# EAGLE design ProductQ (EAGLE 8.6.1)
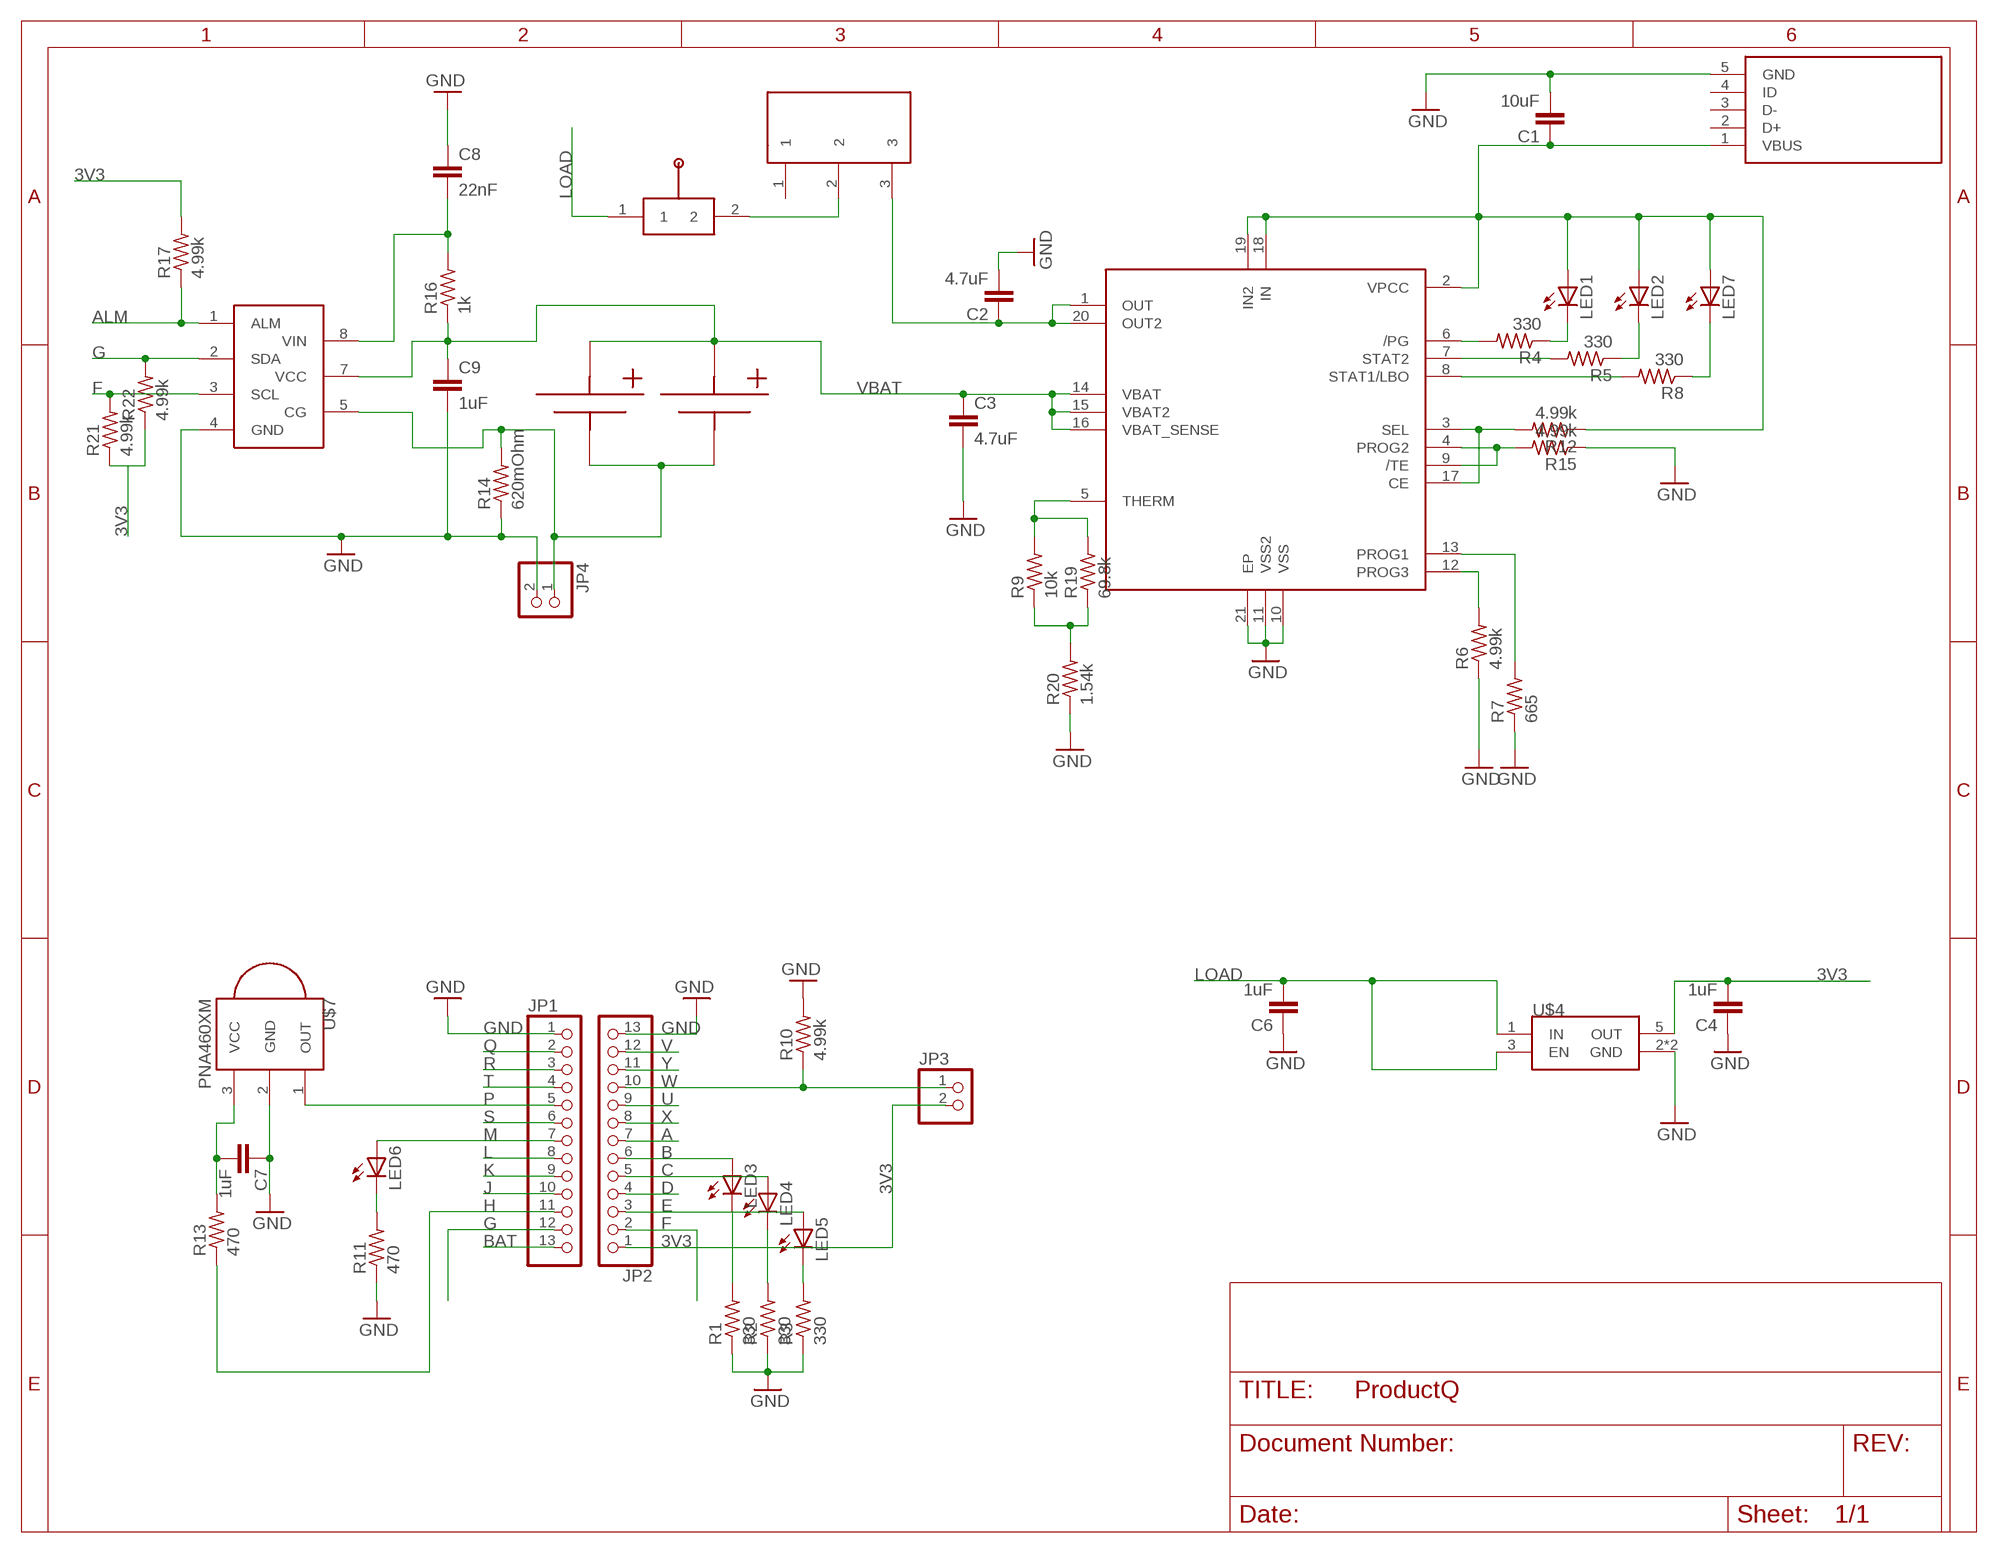
[diagram p0: schematic, sheet 1]

## Parts
C1  10uF  C-EUC0402  [C0402]
C2  4.7uF  C-EUC0402  [C0402]
C3  4.7uF  C-EUC0402  [C0402]
C4  1uF  C-EUC0402  [C0402]
C6  1uF  C-EUC0402  [C0402]
C7  1uF  C-EUC0402  [C0402]
C8  22nF  C-EUC0402  [C0402]
C9  1uF  C-EUC0402  [C0402]
JP1  PINHD-1X13  [1X13]
JP2  PINHD-1X13  [1X13]
JP3  PINHD-1X2/90  [1X02/90]
JP4  PINHD-1X2  [1X02]
LED1  LEDCHIP-LED0805  [CHIP-LED0805]
LED2  LEDCHIP-LED0805  [CHIP-LED0805]
LED3  LEDCHIP-LED0805  [CHIP-LED0805]
LED4  LEDCHIP-LED0805  [CHIP-LED0805]
LED5  LEDCHIP-LED0805  [CHIP-LED0805]
LED6  LED3MM  [LED3MM]
LED7  LEDCHIP-LED0805  [CHIP-LED0805]
R1  330  R-US_R0402  [R0402]
R2  330  R-US_R0402  [R0402]
R3  330  R-US_R0402  [R0402]
R4  330  R-US_R0402  [R0402]
R5  330  R-US_R0402  [R0402]
R6  4.99k  R-US_R0402  [R0402]
R7  665  R-US_R0402  [R0402]
R8  330  R-US_R0402  [R0402]
R9  10k  R-US_R0402  [R0402]
R10  4.99k  R-US_R0402  [R0402]
R11  470  R-US_R0402  [R0402]
R12  4.99k  R-US_R0402  [R0402]
R13  470  R-US_R0402  [R0402]
R14  620mOhm  R-US_R0603  [R0603]
R15  4.99k  R-US_R0402  [R0402]
R16  1k  R-US_R0402  [R0402]
R17  4.99k  R-US_R0402  [R0402]
R19  69.8k  R-US_R0402  [R0402]
R20  1.54k  R-US_R0402  [R0402]
R21  4.99k  R-US_R0402  [R0402]
R22  4.99k  R-US_R0402  [R0402]
U$1  MCP73871  [QFN_20]
U$2  SPDT_THRU  [SPDT_THRU]
U$3  USB_MINI  [USB_MINI]
U$4  TPS782XX  [SOT23-5L]
U$5  18650SMD  [18650KEYSTONE]
U$6  18650SMD  [18650KEYSTONE]
U$7  PNA460XM  [PNA460XM]
U$8  STC3105  [STC3105]
U$9  MANUAL_SWITCH  [MANUAL_SWITCH]

## Nets
3V3: C4.2 JP2.1 JP3.2 R17.2 R21.1 R22.1 U$4.5(OUT)
A: JP2.7
ALM: R17.1 U$8.1(ALM)
B: JP2.6 LED3.A
BAT: JP1.13
C: JP2.5 LED4.A
D: JP2.4
E: JP2.3 LED5.A
F: JP2.2 R21.2 U$8.3(SCL)
G: JP1.12 R22.2 U$8.2(SDA)
GND: C1.2 C2.2 C3.2 C4.1 C6.1 C7.1 C8.1 C9.2 JP1.1 JP2.13 JP4.2 R1.1 R2.1 R3.1 R6.1 R7.1 R10.2 R11.1 R14.1 R15.1 R20.1 U$1.10(VSS) U$1.11(VSS2) U$1.21(EP) U$3.5(GND) U$4.2(GND) U$4.4(GND) U$7.2(GND) U$8.4(GND)
H: JP1.11 R13.1
J: JP1.10
K: JP1.9
L: JP1.8
LOAD: C6.2 U$4.1(IN) U$4.3(EN) U$9.1
M: JP1.7 LED6.A
N$1: JP4.1 R14.2 U$5.P$2 U$6.P$2 U$8.5(CG)
N$2: R9.2 R19.2 U$1.5(THERM)
N$3: R7.2 U$1.13(PROG1)
N$4: R6.2 U$1.12(PROG3)
N$5: LED6.K(C) R11.2
N$6: LED4.C R2.2
N$7: R4.2 U$1.6(/PG)
N$8: LED1.C R4.1
N$9: LED2.C R5.1
N$10: R5.2 U$1.7(STAT2)
N$11: R8.2 U$1.8(STAT1/LBO)
N$12: LED7.C R8.1
N$13: LED5.C R3.2
N$14: LED3.C R1.2
N$15: C8.2 R16.2 U$8.8(VIN)
N$16: C1.1 LED1.A LED2.A LED7.A R12.1 U$1.2(VPCC) U$1.18(IN) U$1.19(IN2) U$3.1(VBUS)
N$17: C7.2 R13.2 U$7.3(VCC)
N$18: R12.2 U$1.3(SEL) U$1.17(CE)
N$20: R15.2 U$1.4(PROG2) U$1.9(/TE)
N$21: U$2.2 U$9.2
N$23: C2.1 U$1.1(OUT) U$1.20(OUT2) U$2.3
N$24: R9.1 R19.1 R20.2
P: JP1.5 U$7.1(OUT)
Q: JP1.2
R: JP1.3
S: JP1.6
T: JP1.4
U: JP2.9
V: JP2.12
VBAT: C3.1 C9.1 R16.1 U$1.14(VBAT) U$1.15(VBAT2) U$1.16(VBAT_SENSE) U$5.P$1 U$6.P$1 U$8.7(VCC)
W: JP2.10 JP3.1 R10.1
X: JP2.8
Y: JP2.11
Unconnected: U$2.1 U$3.2(D+) U$3.3(D-) U$3.4(ID)

## Library data of the parts
C1-C4 C6-C9 = rcl:C-EU: CAPACITOR, European symbol
JP1 JP2 = pinhead:PINHD-1X13: PIN HEADER
JP3 JP4 = pinhead:PINHD-1X2: PIN HEADER
LED1-LED7 = adafruit:LED: LED OSRAM: - CHIPLED LG R971, LG N971, LY N971, LG Q971, LY Q971, LO R971, LY R971 LH N974, LH R974 LS Q976, LO Q976, LY Q976 LO Q996 - Hyper CHIPLED LW Q18S LB Q993, LB Q99A, LB R99A - SideLED LS A670, LO A670, LY A670, LG A670, LP A670 LB A673, LV A673, LT A673, LW A673 LH A674 LY A675 LS A676, LA A676, LO A676, LY A676, LW A676 LS A679, LY A679, LG A679 - Hyper Micro SIDELED® LS Y876, LA Y876, LO Y876, LY Y876 LT Y87S - SmartLED LW L88C, LW L88S LB L89C, LB L89S, LG L890 LS L89K, LO L89K, LY L89K LS L896, LA L896, LO L896, LY L896 - TOPLED LS T670, LO T670, LY T670, LG T670, LP T670 LSG T670, LSP T670, LSY T670, LOP T670, LYG T670 LG T671, LOG T671, LSG T671 LB T673, LV T673, LT T673, LW T673 LH T674 LS T676, LA T676, LO T676, LY T676, LB T676, LH T676, LSB T676, LW T676 LB T67C, LV T67C, LT T67C, LS T67K, LO T67K, LY T67K, LW E67C LS E67B, LA E67B, LO E67B, LY E67B, LB E67C, LV E67C, LT E67C LW T67C LS T679, LY T679, LG T679 LS T770, LO T770, LY T770, LG T770, LP T770 LB T773, LV T773, LT T773, LW T773 LH T774 LS E675, LA E675, LY E675, LS T675 LS T776, LA T776, LO T776, LY T776, LB T776 LHGB T686 LT T68C, LB T68C - Hyper Mini TOPLED® LB M676 - Mini TOPLED Santana® LG M470 LS M47K, LO M47K, LY M47K Source: http://www.osram.convergy.de/
R1-R17 R19-R22 = rcl:R-US_: RESISTOR, American symbol
U$1 = James_Updated:MCP73871
U$2 = James_Updated:SPDT_THRU
U$3 = James_Updated:USB_MINI
U$4 = James_Updated[Conflict]:TPS782XX: TPS782 500-nA IQ,150-mA, Ultra-Low Quiescent Current Low-Dropout Linear Regulator
U$5 U$6 = Charles:18650: 18650 Battery Cell Holder
U$7 = adafruit:PNA460XM: IR 38KHz receiver PNA4602 and related receivers http://www.ladyada.net/library/pcb/eaglelibrary.html
U$8 = James_Updated:STC3105: Battery monitor IC with alarm output for gas gauge applications
U$9 = James_Updated:MANUAL_SWITCH

## Board
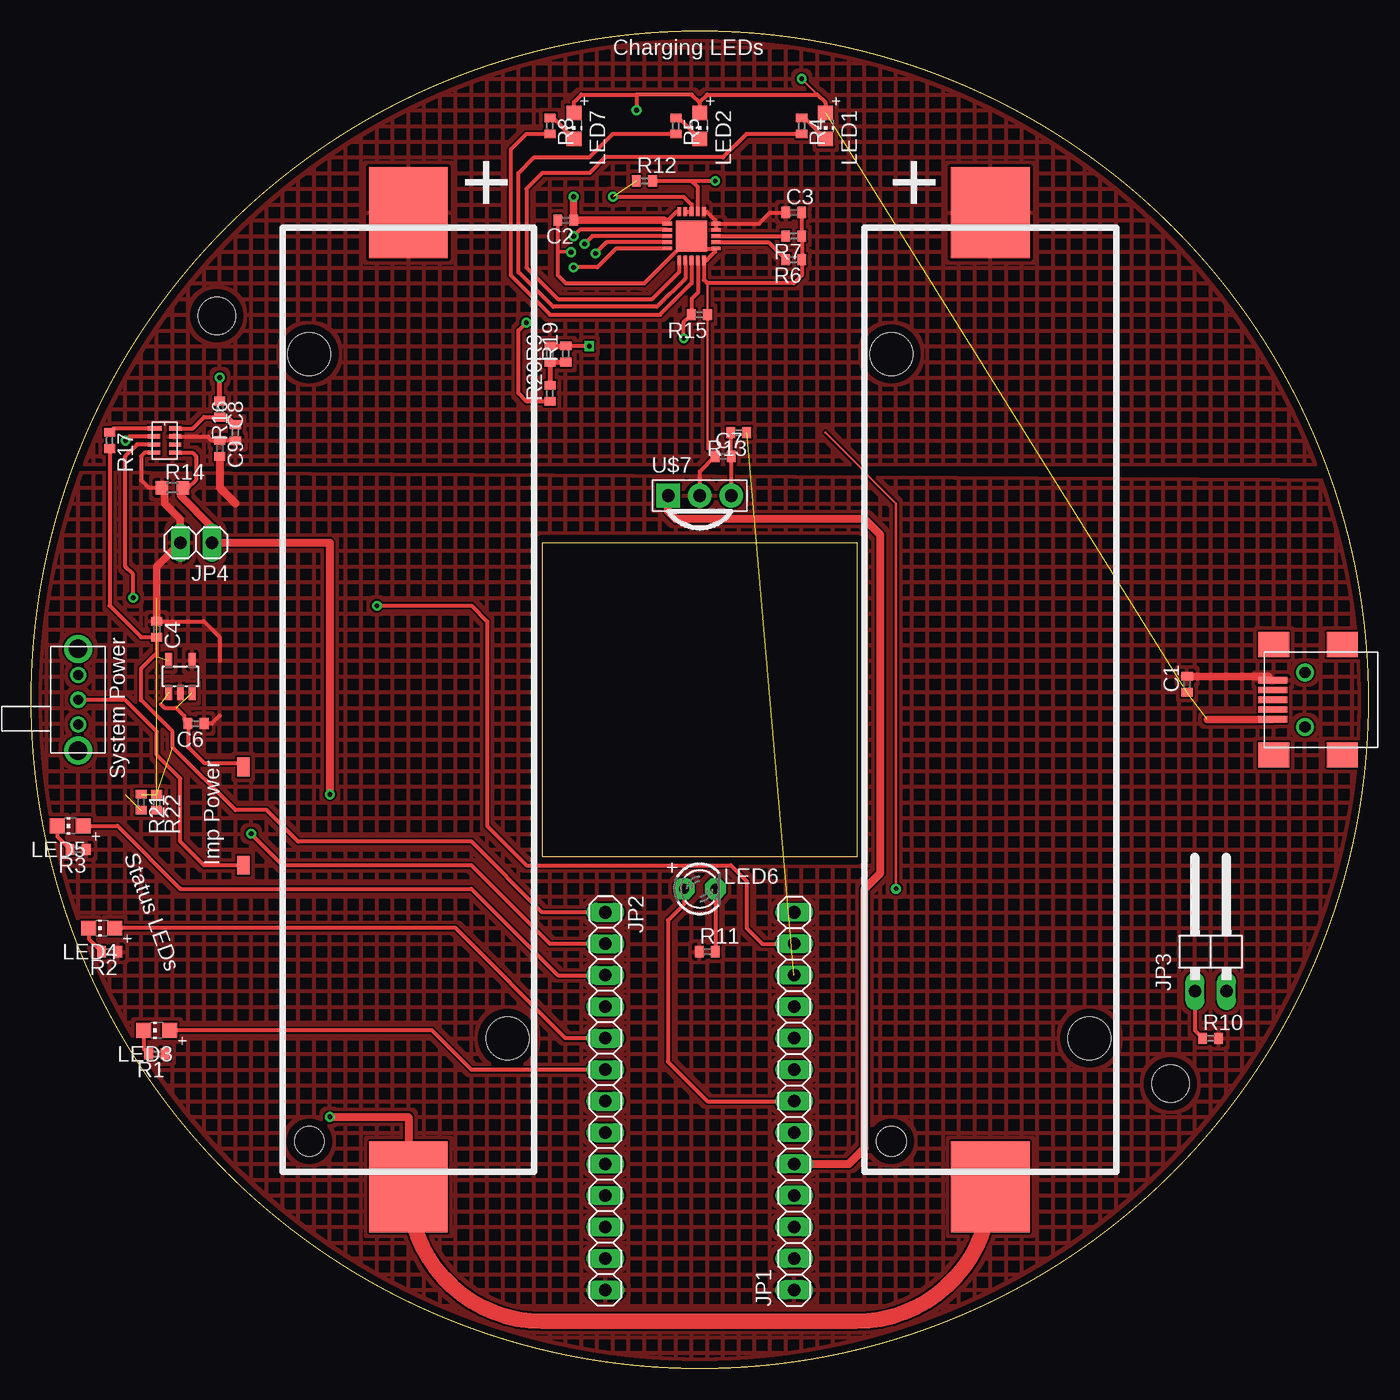
[diagram p1: board, top side]
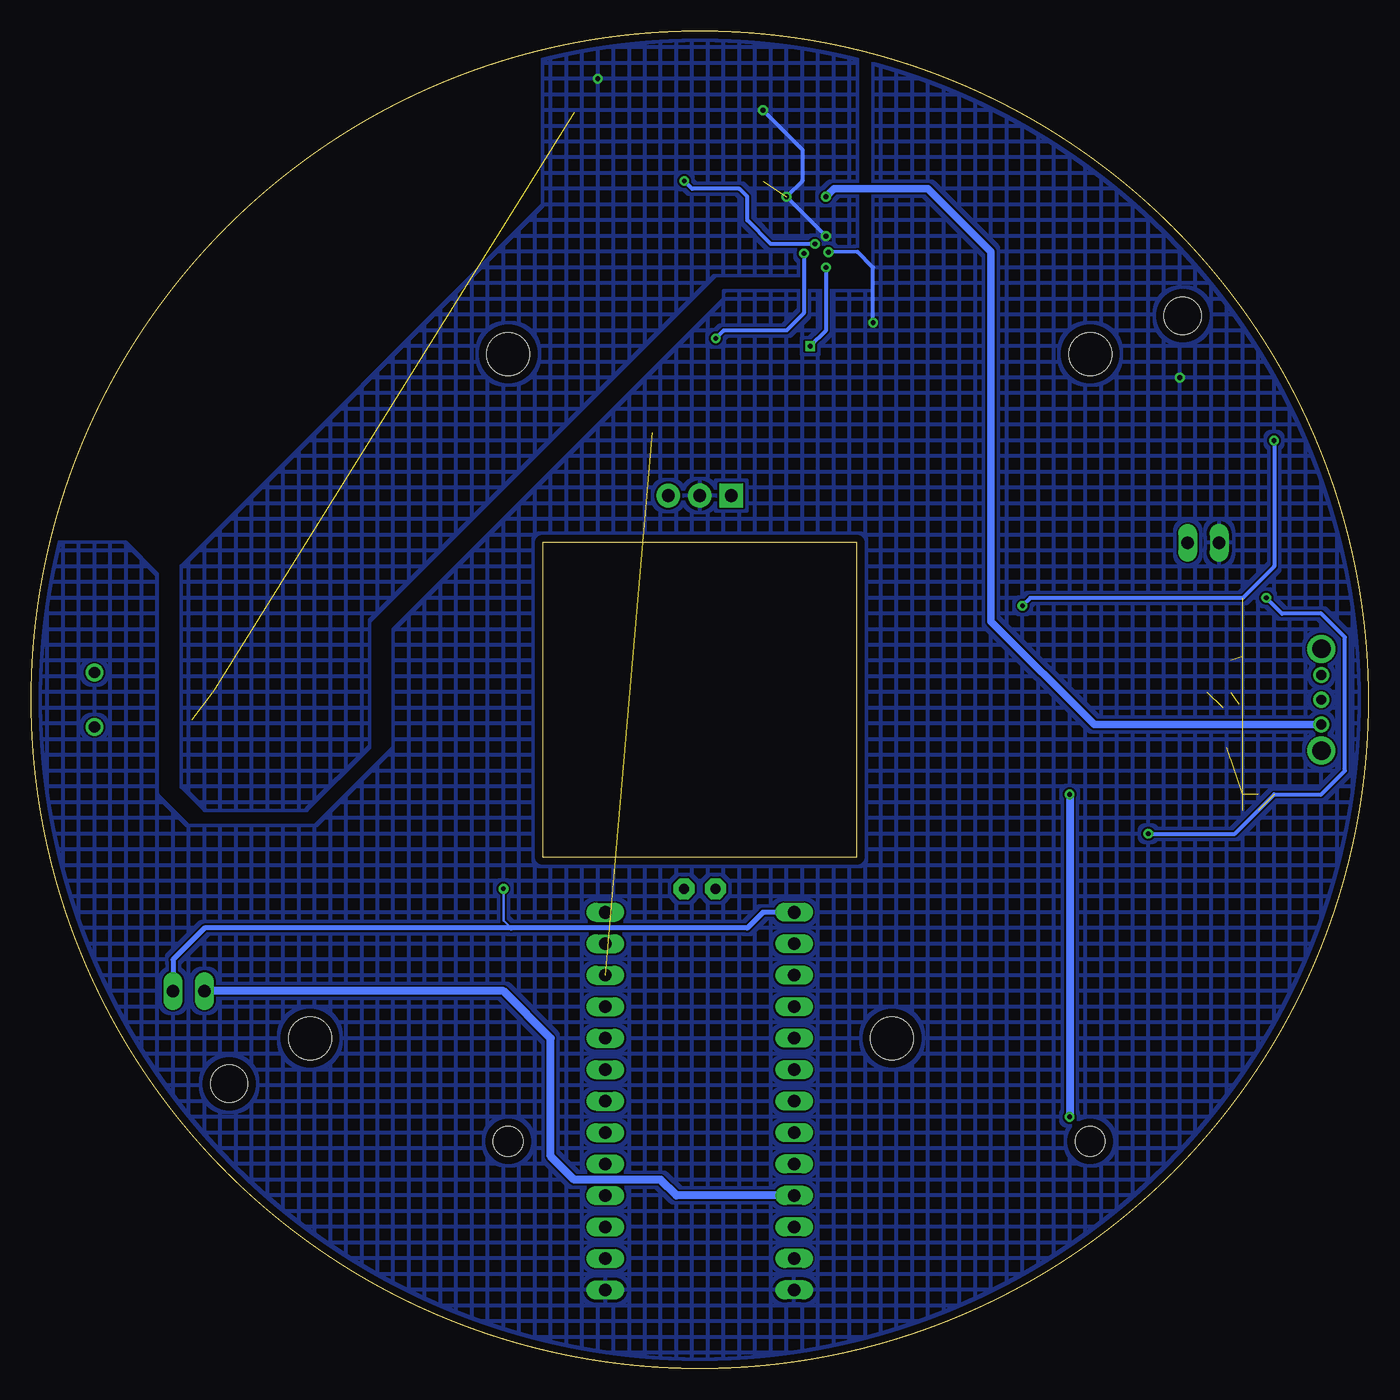
[diagram p2: board, bottom side, seen from below]

Size 108 x 108 mm. Coordinates in mm from the lower left corner, seen from the top.
Outline: 41.3,66.7 66.7,66.7 66.7,41.3 41.3,41.3 41.3,66.7
Outline: circle at 54,54 radius 54
Copper layers (1*16): Top 0.035mm / dielectric 1.5mm / Bottom 0.035mm
Design rules "DRC_rules": minimum track width 8mil, minimum drill 15mil, track to track 6mil, track to pad 6mil, pad to pad 6mil, via to via 6mil, smd to smd 6mil, copper to edge 25mil, drill to drill 6mil, minimum pad ring 10mil, minimum via ring 8mil, stop-mask expansion 4mil, vias tented up to drill 0mil, thermal gap 10mil
Holes 3 mm at 92,23 15,85

### Footprints (pad centres in the part's own frame; a part is rotated, then mirrored left to right if it is on the bottom)
C0402 = smd 0.7 x 0.9: 1 -0.65,0; 2 0.65,0
1X13 = drill 1.016 long: 1 -15.24,0; 2 -12.7,0; 3 -10.16,0; 4 -7.62,0; 5 -5.08,0; 6 -2.54,0; 7 0,0; 8 2.54,0; 9 5.08,0; 10 7.62,0; 11 10.16,0; 12 12.7,0; 13 15.24,0
1X02/90 = drill 1.016 long: 1 -1.27,-3.81; 2 1.27,-3.81
1X02 = drill 1.016 long: 1 -1.27,0; 2 1.27,0
CHIP-LED0805 = smd 1.2 x 1.2: A 0,-1.05; C 0,1.05
LED3MM = drill 0.813 pad 1.676 octagon: A -1.27,0; K 1.27,0
R0402 = smd 0.7 x 0.9: 1 -0.65,0; 2 0.65,0
R0603 = smd 1 x 1.1: 1 -0.85,0; 2 0.85,0
QFN_20 = smd 0.73 x 0.3: 1 -1.965,1; 2 -1.965,0.5; 3 -1.965,0; 4 -1.965,-0.5; 5 -1.965,-1; 11 1.965,-1; 12 1.965,-0.5; 13 1.965,0; 14 1.965,0.5; 15 1.965,1 | smd 0.3 x 0.73: 6 -1,-1.965; 7 -0.5,-1.965; 8 0,-1.965; 9 0.5,-1.965; 10 1,-1.965; 16 1,1.965; 17 0.5,1.965; 18 0,1.965; 19 -0.5,1.965; 20 -1,1.965 | smd 2.5 x 2.5: 21 0,0
SPDT_THRU = drill 0.787: 1 -2.007,0; 2 0,0; 3 2.007,0 | drill 1.499: A1 -4.102,0; A2 4.102,0
USB_MINI = smd 0.508 x 2.311: 1 -1.575,2.603; 2 -0.787,2.603; 3 0,2.603; 4 0.787,2.603; 5 1.575,2.603 | smd 2.007 x 2.489: S1 -4.445,2.515; S2 4.445,2.515; S3 -4.445,-2.997; S4 4.445,-2.997 | drill 0.914: S5 -2.197,0; S6 2.197,0
SOT23-5L = smd 0.55 x 1.2: 1 -0.95,-1.3; 2 0,-1.3; 3 0.95,-1.3; 4 0.95,1.3; 5 -0.95,1.3
18650KEYSTONE = smd 7.341 x 6.35: P$1 -39.332,0; P$2 39.332,0 | hole 3.454: 27.33,8.001; -27.915,-8.001 | hole 2.388: 35.662,-8.001
PNA460XM = drill 1.016 pad 1.93 square: 1 -2.54,0 | drill 1.016 pad 1.93: 2 0,0; 3 2.54,0
STC3105 = smd 0.35 x 1.1: 1 -0.975,-0.8 | smd 0.35 x 1: 2 -0.325,-0.85; 3 0.325,-0.85; 4 0.975,-0.85; 5 0.975,0.85; 6 0.325,0.85; 7 -0.325,0.85; 8 -0.975,0.85
MANUAL_SWITCH = smd 1.524 x 1.016: 1 -4.13,0; 2 3.81,0

### Placement (x,y rotation side)
C1  93.34,55.24 90 top
C2  43.18,92.71 180 top
C3  61.59,93.34 0 top
C4  10.16,59.69 270 top
C6  13.34,52.07 180 top
C7  55.88,73.66 0 top
C8  15.24,77.47 270 top
C9  15.24,74.3 270 top
JP1  61.62,21.59 90 top
JP2  46.38,21.59 270 top
JP3  95.25,34.29 0 top
JP4  13.34,66.67 180 top
LED1  64.16,100.33 180 top
LED2  54,100.33 180 top
LED3  10.16,27.3 90 top
LED4  5.71,35.56 90 top
LED5  3.17,43.81 90 top
LED6  54,38.73 0 top
LED7  43.84,100.33 180 top
R1  10.16,25.4 180 top
R2  6.35,33.66 180 top
R3  3.81,41.91 180 top
R4  62.23,100.33 270 top
R5  52.07,100.33 270 top
R6  61.59,89.53 180 top
R7  61.59,91.44 180 top
R8  41.91,100.33 270 top
R9  41.91,81.92 90 top
R10  95.25,26.67 0 top
R11  54.61,33.66 0 top
R12  49.53,95.89 0 top
R13  57.15,75.56 180 top
R14  11.43,71.12 0 top
R15  53.98,85.09 180 top
R16  16.51,75.56 90 top
R17  6.35,74.93 270 top
R19  43.18,81.92 90 top
R20  41.91,78.74 90 top
R21  8.89,45.72 270 top
R22  10.16,45.72 270 top
U$1  53.34,91.44 0 top
U$2  3.81,54 270 top
U$3  102.87,54 90 top
U$4  12.06,55.88 0 top
U$5  77.47,54 270 top
U$6  30.48,54 270 top
U$7  54,70.48 0 top
U$8  10.79,74.93 270 top
U$9  17.14,44.45 270 top

### Tracks (layer width: path | path; a pad name or v marks a point on that pad's centre or on a via)
3V3  (via drill 0.38)  (3 unrouted)
  Top 0.203: 64.14,75.56 69.85,69.85 v69.85,38.73
  Top 0.305: 10.16,57.78 C4.2 10.14,59.05 8.89,59.05 6.35,61.59 R17.2 | 10.16,57.78 10.16,57.5 | JP2.1 41.27,36.83 35.56,42.55 21.59,42.55 19.05,45.09 16.51,45.09 11.43,50.16 11.43,51.44 8.89,53.98 8.89,56.52 10.16,57.78
  Bottom 0.203: v69.85,38.73 69.85,36.2 69.22,35.56
  Bottom 0.406: JP2.1 48.9,36.83 50.16,35.56 69.22,35.56 93.98,35.56 96.52,33.02 JP3.2
ALM
  Top 0.305: U$8.1 6.67,75.91 R17.1
B
  Top 0.305: JP2.6 35.56,24.13 32.38,27.3 LED3.A
C
  Top 0.305: JP2.5 43.18,26.67 34.29,35.56 LED4.A
E
  Top 0.305: LED5.A 6.99,43.81 12.06,38.73 35.56,38.73 42.55,31.75 JP2.3
F  (via drill 0.38)  (1 unrouted)
  Top 0.305: JP2.2 41.91,34.29 35.56,40.64 20.32,40.64 v17.78,43.18 | v8.26,62.23 8.26,64.14 7.62,64.77 7.62,73.66 8.56,74.61 U$8.3
  Bottom 0.305: v17.78,43.18 10.79,43.18 7.62,46.35 3.81,46.35 1.91,48.26 1.91,59.05 3.81,60.96 6.99,60.96 v8.26,62.23
G  (via drill 0.38)  (1 unrouted)
  Top 0.305: U$8.2 7.95,75.25 v7.62,74.93 | v27.94,61.59 35.56,61.59 36.83,60.33 36.83,43.81 40.01,40.64 56.52,40.64 57.78,39.37 57.78,35.56 59.05,34.29 JP1.12
  Bottom 0.305: v7.62,74.93 7.62,64.77 10.16,62.23 27.3,62.23 v27.94,61.59
GND  (via drill 0.38)
  Top 0.203: 54.61,87.63 54.61,85.11 R15.1 54.62,74.27 C7.1
  Top 0.305: U$7.2 54,72.43 C7.1 | 15.26,52.72 14.61,52.07 C6.1 | C4.1 10.16,60.33 13.97,60.33 15.24,59.05 15.24,57.16 | 10.79,71.11 R14.1 9.53,71.12 8.89,71.75 8.89,73.66 9.19,73.95 U$8.4 | 55.24,90.38 55.24,90.17 54.55,89.47 U$1.10 54.34,87.9 54.61,87.63 61.59,87.63 62.24,88.28 R7.1 | 55.24,90.38 U$1.11 | R7.1 C3.2 | R7.1 R6.1 | C2.2 42.53,90.17 | 42.53,90.17 42.53,88.28 43.18,87.63 49.52,87.63 49.52,87.61 U$1.21 54.4,90.38 55.24,90.38 | 99.95,55.9 U$3.5 | R20.1 40.02,78.09 39.37,78.74 39.37,83.82 v40.01,84.45 | v43.61,90.14 42.53,90.17
  Top 0.406: C8.1 v15.24,80.01
  Top 0.61: 10.79,71.11 10.79,69.85 12.06,68.58 JP4.2 10.16,64.77 C4.1 | C1.2 99.95,55.9
  Top 0.635: C9.2 15.24,71.12 16.51,69.85
  Bottom 0.305: v40.01,84.45 40.01,88.9 41.27,90.17 v43.61,90.14
  pour Top (hatched): 3.17,72.39 107.31,71.75 114.3,64.77 114.3,12.7 100.33,-1.27 20.32,0.64 -0.64,21.59 -1.27,67.94
  pour Bottom (hatched): -1.27,71.75 -1.27,85.72 22.23,109.22 38.73,109.22 40.01,107.95 40.01,87 52.07,87 52.07,86.36 78.74,59.69 78.74,50.16 85.09,43.81 95.25,43.81 97.79,46.35 97.79,64.14 100.33,66.67 108.58,66.67 111.12,64.14 103.5,15.88 87,-0.64 30.48,-1.27 -1.27,33.66 -2.54,68.58
H  (1 unrouted)
LOAD  (2 unrouted)
  Top 0.305: 10.48,53.66 10.79,53.34 11.74,53.34 12.38,52.7 12.38,52.38 C6.2 12.69,50.18 13.97,48.9 16.83,48.9 U$9.1
M
  Top 0.305: LED6.A 52.73,37.49 51.44,36.2 51.44,24.77 54.61,21.59 JP1.7
N$1  (via drill 0.38)
  Top 0.305: R14.2 12.7,71.12 13.34,71.75 13.34,73.66 13.04,73.95 U$8.5
  Top 0.61: R14.2 12.08,70.47 14.61,67.94 JP4.1
  Top 0.635: JP4.1 24.13,66.67 v24.13,46.35 | v24.13,20.32 30.48,20.32 U$6.P$2
  Top 1.27: 30.48,14.61 arc90 41.27,3.81 66.61,3.81 arc90 U$5.P$2
  Top 2.54: U$6.P$2 30.48,14.61
  Bottom 0.635: v24.13,46.35 v24.13,20.32
N$2  (via drill 0.38)
  Top 0.305: U$1.5 47.26,90.44 45.73,88.92 43.81,88.92 v43.81,88.9 | v45.09,82.55 43.2,82.55 R19.2
  Top 0.406: R9.2 R19.2
  Bottom 0.305: v43.81,88.9 43.81,83.82 v45.09,82.55
N$3
  Top 0.305: 55.24,91.44 U$1.13 R7.2
N$4
  Top 0.305: U$1.12 59.54,90.94 R6.2
N$5
  Top 0.305: LED6.K R11.2
N$6
  Top 0.305: LED4.C 4.67,34.69 R2.2
N$7
  Top 0.305: R4.2 57.77,99.68 55.88,97.79 46.35,97.79 45.09,96.52 41.27,96.52 40.01,95.25 40.01,88.9 42.55,86.36 50.16,86.36 52.34,88.53 U$1.6
N$8
  Top 0.305: R4.1 62.46,100.98 LED1.C
N$9
  Top 0.305: R5.1 52.3,100.98 LED2.C
N$10
  Top 0.305: U$1.7 52.84,88.02 50.55,85.72 42.16,85.72 39.37,88.52 39.37,96.52 40.64,97.79 45.09,97.79 46.99,99.69 52.05,99.69 R5.2
N$11
  Top 0.305: R8.2 39.99,99.68 38.73,98.42 38.73,88.27 41.91,85.09 50.8,85.09 53.34,87.63 U$1.8
N$12
  Top 0.305: R8.1 42.14,100.98 LED7.C
N$13
  Top 0.305: LED5.C 2.12,42.95 R3.2
N$14
  Top 0.305: LED3.C 9.11,25.8 R1.2
N$15
  Top 0.305: R16.2 15.9,76.82 C8.2 15.22,76.83 13.97,76.83 13.04,75.91 U$8.8
N$16  (via drill 0.38)  (3 unrouted)
  Top 0.203: LED1.A 64.16,102.21 v62.23,104.14
  Top 0.305: C1.1 | LED7.A 43.84,102.26 44.45,102.87 48.9,102.87 | 53.98,102.23 53.34,102.87 48.9,102.87 | 53.98,102.23 54.61,102.87 63.5,102.87 64.14,102.23 64.14,101.41 LED1.A | U$1.2 44.31,91.94 v43.81,91.44 | v46.99,94.61 52.7,94.61 53.34,93.98 U$1.18 U$1.19 | LED2.A 54,102.21 53.98,102.23 | 48.9,102.87 v48.9,101.6
  Top 0.61: U$3.1 94.98,52.42
  Bottom 0.305: v43.81,91.44 v46.99,94.61 45.72,95.89 45.72,98.42 v48.9,101.6
  pour Bottom (hatched): 41.27,88.27 41.27,106.68 43.18,108.58 64.77,108.58 66.67,106.68 66.67,93.98 95.89,64.77 95.89,46.99 93.98,45.09 85.72,45.09 80.64,50.16 80.64,60.33 61.59,79.38 52.7,88.27
N$17
  Top 0.305: U$7.3 56.53,70.5 C7.2 56.5,73.69 R13.2
N$18  (via drill 0.38)
  Top 0.305: U$1.17 53.84,95.39 53.34,95.89 | 53.34,95.89 R12.2 | U$1.3 45.34,91.44 v44.7,90.81 | v55.24,95.89 53.34,95.89
  Bottom 0.305: v44.7,90.81 48.26,90.81 50.16,92.71 50.16,94.61 50.8,95.25 54.61,95.25 v55.24,95.89
N$20  (via drill 0.38)
  Top 0.305: U$1.9 53.84,86.86 53.34,86.36 53.34,85.11 R15.2 52.7,84.47 v52.7,83.19 | U$1.4 46.49,90.94 v45.59,90.04
  Bottom 0.305: v45.59,90.04 45.59,85.22 46.99,83.82 52.07,83.82 v52.7,83.19
N$21
  Top 0.305: U$9.2 13.97,40.64 12.06,42.55 12.06,47.62 10.16,49.53 10.16,51.44 7.62,53.98 3.83,53.98 U$2.2
N$23  (via drill 0.38)
  Top 0.203: 43.81,92.72 C2.1
  Top 0.305: U$1.20 52.13,93.41 51.44,92.71 51.44,92.5 U$1.1 51.1,92.71
  Top 0.61: C2.1 51.1,92.71 | v43.81,94.61 43.81,92.72
  Bottom 0.61: U$2.3 22.15,51.99 30.48,60.33 30.48,90.17 35.56,95.25 43.18,95.25 v43.81,94.61
N$24
  Top 0.406: R19.1 R9.1 R20.2
P
  Top 0.635: JP1.5 66.04,16.51 67.31,17.78 67.31,38.73 68.58,40.01 68.58,67.31 67.31,68.58 52.07,68.58 51.44,69.22 51.44,70.46 U$7.1
VBAT
  Top 0.305: R16.1 15.27,74.92 C9.1 15.22,74.93 14.61,74.93 14.28,75.25 U$8.7 | U$1.15 U$1.14 | U$1.16 54.55,93.41 55.24,92.71 55.24,92.5 U$1.15 | U$1.15 58.78,92.44 59.69,93.34 C3.1
  pour Top (hatched): 106.68,73.03 108.58,74.3 108.58,93.98 94.61,107.95 21.59,107.95 2.54,88.9 2.54,73.03
W
  Top 0.305: JP3.1 93.98,27.29 R10.1
  Bottom 0.635: JP2.10 55.88,13.97 57.15,15.24 64.14,15.24 66.04,17.14 66.04,26.67 69.85,30.48 JP3.1

### Text on the board
tPlace: Charging LEDs | + | + | System Power | Imp Power | Status LEDs